# Altium schematic sheet Fan.SchDoc: Fan & Heater Control
size A4; Engineer: A. Küllenberg; Revision: A; SheetNumber: 9; SheetTotal: 10
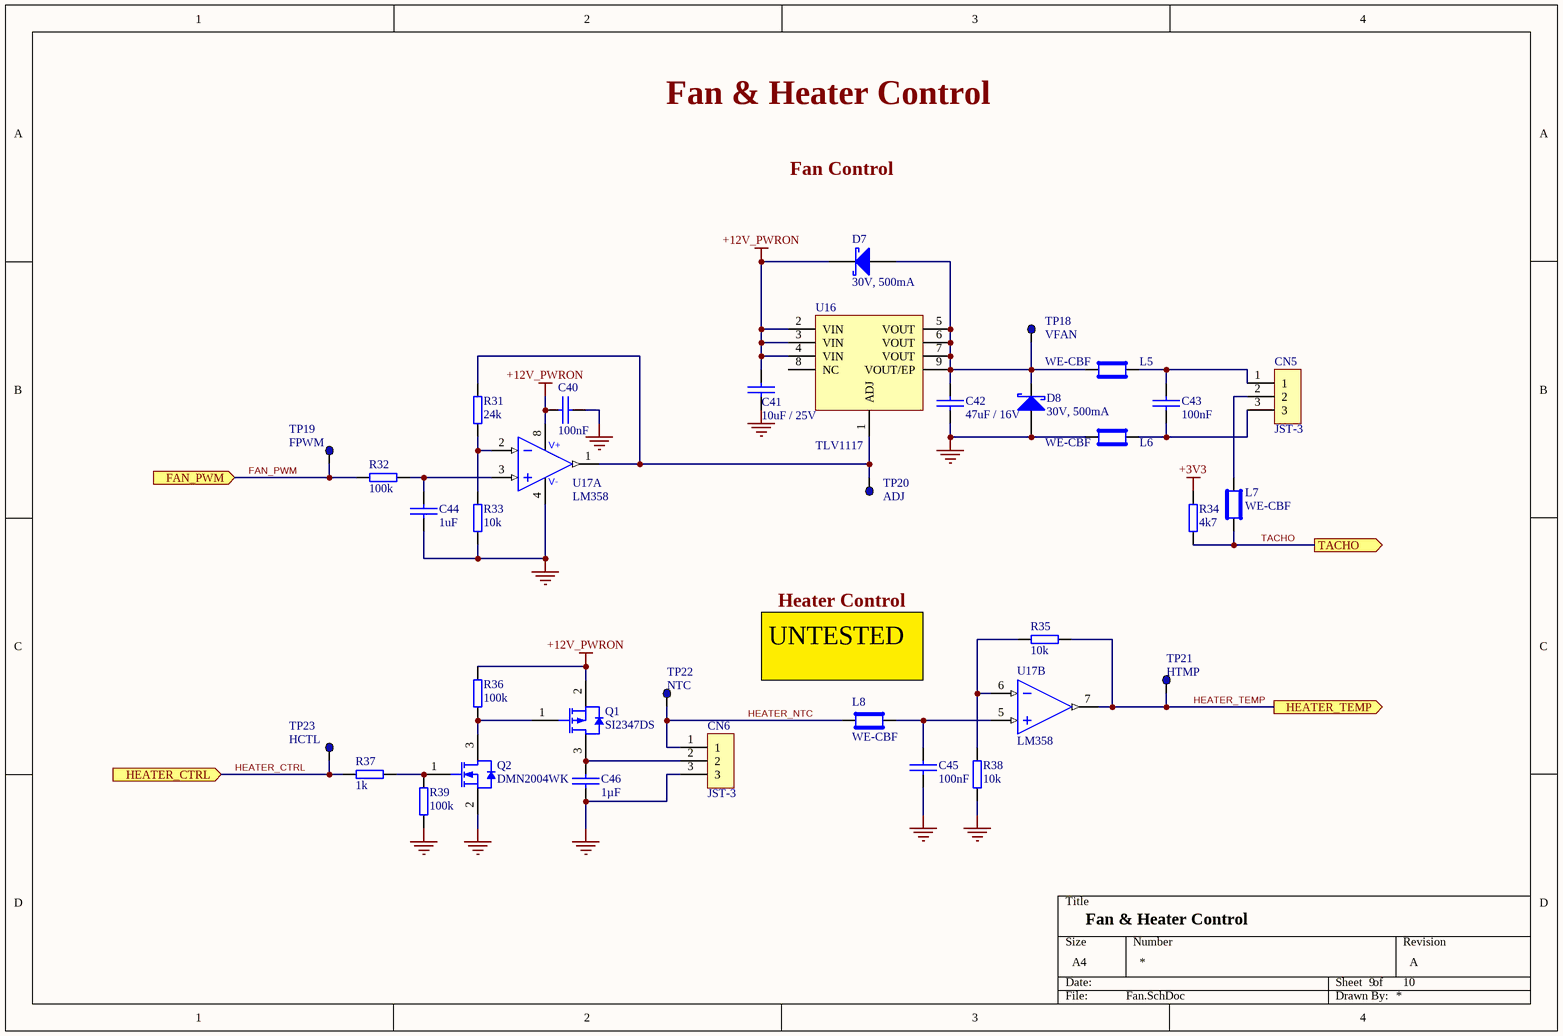
[diagram p0: Fan.SchDoc]

## Parts
C40  100nF  [C0603]
C41  10uF / 25V  [C0603]
C42  47uF / 16V  [C1206]
C43  100nF  [C0603]
C44  1uF  [C0603]
C45  100nF  [C0603]
C46  1µF  [C0805]
CN5  JST-3  [JST-3]
CN6  JST-3  [JST-3]
D7  30V, 500mA  [SOD523_N]
D8  30V, 500mA  [SOD523_N]
L5  WE-CBF  [L0603]
L6  WE-CBF  [L0603]
L7  WE-CBF  [L0603]
L8  WE-CBF  [L0603]
Q1  SI2347DS  [SOT23-3_N]
Q2  DMN2004WK  [SC-70]
R31  24k  [R0603]
R32  100k  [R0603]
R33  10k  [R0603]
R34  4k7  [R0603]
R35  10k  [R0603]
R36  100k  [R0603]
R37  1k  [R0603]
R38  10k  [R0603]
R39  100k  [R0603]
TP18  VFAN  [TP_1mm]  (no BOM)
TP19  FPWM  [TP_1mm]  (no BOM)
TP20  ADJ  [TP_1mm]  (no BOM)
TP21  HTMP  [TP_1mm]  (no BOM)
TP22  NTC  [TP_1mm]  (no BOM)
TP23  HCTL  [TP_1mm]  (no BOM)
U16  TLV1117  [QFN80P400X400X80_HS-9N]
U17  LM358  [DFN 2x2_LM358]  (parts A,B of 2)

## Ports
FAN_PWM (in), HEATER_CTRL (in), HEATER_TEMP (out), TACHO (out)

## Nets
+3V3: R34.2
+12V_PWRON: C40.1 C41.2 D7.2(K) Q1.2(S) R36.2 U16.2(VIN) U16.3(VIN) U16.4(VIN) U17.8(V+)
GND: C40.2 C41.1 C42.1 C44.1 C45.1 C46.1 CN6.3 D8.1(A) L6.1 Q2.2(S) R33.2 R38.1 R39.1 U17.4(V-)
FAN_PWM: R32.1 TP19.1 ; port FAN_PWM
HEATER_CTRL: R37.2 TP23.1 ; port HEATER_CTRL
HEATER_NTC: CN6.1 L8.1 TP22.1
HEATER_TEMP: R35.2 TP21.1 U17.7(OUT) ; port HEATER_TEMP
TACHO: L7.1 R34.1 ; port TACHO
NetC42_2: C42.2 D7.1(A) D8.2(K) L5.1 TP18.1 U16.5(VOUT) U16.6(VOUT) U16.7(VOUT) U16.9(VOUT/EP)
NetC43_1: C43.1 CN5.3 L6.2
NetC43_2: C43.2 CN5.1 L5.2
NetC44_2: C44.2 R32.2 U17.3(IN+)
NetC45_2: C45.2 L8.2 U17.5(IN+)
NetC46_2: C46.2 CN6.2 Q1.3(D)
NetCN5_2: CN5.2 L7.2
NetQ1_1: Q1.1(G) Q2.3(D) R36.1
NetQ2_1: Q2.1(G) R37.1 R39.2
NetR31_1: R31.1 R33.1 U17.2(IN-)
NetR31_2: R31.2 TP20.1 U16.1(ADJ) U17.1(OUT)
NetR35_1: R35.1 R38.2 U17.6(IN-)

Not connected (* = marked no-connect by the designer): U16 8(NC)

## Notes on the sheet
- Fan & Heater Control
- Fan Control
- Heater Control
- (near L8) UNTESTED

## Library data of the parts
C40 C43 C45 = C0603C104K5RACTU: CAP CER 0.1UF 50V X7R 0603; Manufacturer: Kemet; Capacitance: 0.10µF; Tolerance: ±10%; Part Number: C0603C104K5RACTU; Value: 100nF; Supplier 1: Digi-Key; Supplier Part Number 1: 399-5089-1-ND; Manufacturer Part Number: C0603C104K5RACTU; RoHS: RoHS Compliant; Category: Capacitors; Stock 1: 1628757; Pricing 1: 1=0.09, 10=0.037, 50=0.0198, 100=0.0167, 250=0.01372, 500=0.01174, 1000=0.00914 (EUR); Packaging: Cut Tape (CT); Voltage - Rated: 50V; Temperature Coefficient: X7R; Mounting Type: Surface Mount, MLCC; Operating Temperature: -55°C ~ 125°C; Applications: General Purpose; Ratings: -; Package / Case: 0603 (1608 Metric); Size / Dimension: 0.063" L x 0.031" W (1.60mm x 0.80mm); Height - Seated (Max): -; Thickness (Max): 0.034" (0.87mm); Lead Spacing: -; Features: -; Lead Style: -; ComponentLink1URL: http://www.kemet.com/docfinder?Partnumber=C0603C104K5RACTU; ComponentLink1Description: http://www.kemet.com/docfinder?Partnumber=C0603C104K5RACTU
C41 = ZRB18AR61E106ME01L: CAP CER 10UF 25V X5R 0603; Manufacturer: Murata Electronics North America; Capacitance: 10µF; Tolerance: ±20%; Part Number: ZRB18AR61E106ME01L; Value: 10uF / 25V; Supplier 1: Digi-Key; Supplier Part Number 1: 490-10991-1-ND; Manufacturer Part Number: ZRB18AR61E106ME01L; RoHS: RoHS Compliant; Category: Capacitors; Stock 1: 23575; Pricing 1: 1=0.4, 10=0.278, 25=0.2284, 50=0.195, 100=0.1671, 250=0.13924, 500=0.12532, 1000=0.10583 (EUR); Packaging: Cut Tape (CT); Voltage - Rated: 25V; Temperature Coefficient: X5R; Mounting Type: Surface Mount, MLCC; Operating Temperature: -55°C ~ 85°C; Applications: Acoustic Noise Reduction; Ratings: -; Package / Case: 0603 (1608 Metric); Size / Dimension: 0.063" L x 0.031" W (1.60mm x 0.80mm); Height - Seated (Max): -; Thickness (Max): 0.047" (1.20mm); Lead Spacing: -; Features: Interposer Termination; Lead Style: -; ComponentLink1URL: http://search.murata.co.jp/Ceramy/image/img/A01X/G101/ENG/ZRB18AR61E106ME01-01.pdf; ComponentLink1Description: http://search.murata.co.jp/Ceramy/image/img/A01X/G101/ENG/ZRB18AR61E106ME01-01.pdf; Part Status: Active
C42 = C3216X5R1C476M160AB: CAP CER 47UF 16V X5R 1206; Manufacturer: TDK Corporation; Capacitance: 47µF; Tolerance: ±20%; Part Number: C3216X5R1C476M160AB; Value: 47uF / 16V; Supplier 1: Digi-Key; Supplier Part Number 1: 445-6003-1-ND; Manufacturer Part Number: C3216X5R1C476M160AB; RoHS: RoHS Compliant; Category: Capacitors; Stock 1: 181623; Pricing 1: 1=0.92, 10=0.724, 25=0.6636, 50=0.6272, 100=0.5427, 250=0.48244, 500=0.41008, 1000=0.36184 (EUR); Packaging: Cut Tape (CT); Voltage - Rated: 16V; Temperature Coefficient: X5R; Mounting Type: Surface Mount, MLCC; Operating Temperature: -55°C ~ 85°C; Applications: General Purpose; Ratings: -; Package / Case: 1206 (3216 Metric); Size / Dimension: 0.126" L x 0.063" W (3.20mm x 1.60mm); Height - Seated (Max): -; Thickness (Max): 0.071" (1.80mm); Lead Spacing: -; Features: Low ESL; Lead Style: -; ComponentLink1URL: https://product.tdk.com/info/en/catalog/datasheets/mlcc_commercial_general_en.pdf; ComponentLink1Description: https://product.tdk.com/info/en/catalog/datasheets/mlcc_commercial_general_en.pdf; Part Status: Active; Failure Rate: -
C44 = GCM188R71E105KA64D: CAP CER 1UF 25V X7R 0603; Manufacturer: Murata Electronics North America; Capacitance: 1µF; Tolerance: ±10%; Part Number: GCM188R71E105KA64D; Value: 1uF; Supplier 1: Digi-Key; Supplier Part Number 1: 490-10673-1-ND; Manufacturer Part Number: GCM188R71E105KA64D; RoHS: RoHS Compliant; Category: Capacitors; Stock 1: 53908; Pricing 1: 1=0.19, 10=0.13, 50=0.0748, 100=0.0617, 250=0.05196, 500=0.04352, 1000=0.03572 (EUR); Packaging: Cut Tape (CT); Voltage - Rated: 25V; Temperature Coefficient: X7R; Mounting Type: Surface Mount, MLCC; Operating Temperature: -55°C ~ 125°C; Applications: Automotive; Ratings: AEC-Q200; Package / Case: 0603 (1608 Metric); Size / Dimension: 0.063" L x 0.031" W (1.60mm x 0.80mm); Height - Seated (Max): -; Thickness (Max): 0.035" (0.90mm); Lead Spacing: -; Features: -; Lead Style: -; ComponentLink1URL: http://www.murata.com/~/media/webrenewal/support/library/catalog/products/capacitor/mlcc/c03e.ashx; ComponentLink1Description: http://www.murata.com/~/media/webrenewal/support/library/catalog/products/capacitor/mlcc/c03e.ashx
C46 = C0805C105K5RACTU: CAP CER 1UF 50V X7R 0805; Manufacturer: Kemet; Tolerance: ±10%; Part Number: C0805C105K5RACTU; Value: 1µF; Supplier 1: Digi-Key; Supplier Part Number 1: 399-7409-1-ND; Manufacturer Part Number: C0805C105K5RACTU; RoHS: RoHS Compliant; Category: Capacitors; Stock 1: 161342; Pricing 1: 1=0.31, 10=0.254, 50=0.1428, 100=0.1268, 250=0.09508, 500=0.084, 1000=0.07449 (EUR); Packaging: Cut Tape (CT); Capacitance: 1µF; Voltage - Rated: 50V; Temperature Coefficient: X7R; Mounting Type: Surface Mount, MLCC; Operating Temperature: -55°C ~ 125°C; Applications: General Purpose; Ratings: -; Package / Case: 0805 (2012 Metric); Size / Dimension: 0.079" L x 0.049" W (2.00mm x 1.25mm); Height - Seated (Max): -; Thickness (Max): 0.055" (1.40mm); Lead Spacing: -; Features: -; Lead Style: -; ComponentLink1URL: http://www.kemet.com/docfinder?Partnumber=C0805C105K5RACTU; ComponentLink1Description: http://www.kemet.com/docfinder?Partnumber=C0805C105K5RACTU
CN5 CN6 = B3B-XH-A(LF)(SN): CONN HEADER XH TOP 3POS 2.5MM; Manufacturer: JST Sales America Inc.; Number of Positions: 3; Number of Positions Loaded: All; Current Rating: 3A; Voltage Rating: 250V; Pitch - Mating: 0.098" (2.50mm); Shrouding: Shrouded - 4 Wall; Style: Board to Cable/Wire; Contact Length - Post: 0.134" (3.40mm); Material Flammability Rating: UL94 V-0; Mated Stacking Heights: 9.8mm; Part Number: B3B-XH-A(LF)(SN); Value: JST-3; Supplier 1: Digi-Key; Supplier Part Number 1: 455-2248-ND; Manufacturer Part Number: B3B-XH-A(LF)(SN); RoHS: RoHS Compliant; Category: Connectors, Interconnects; Stock 1: 206315; Pricing 1: 1=0.18, 10=0.171, 100=0.1053, 500=0.08712, 1000=0.07623, 5000=0.06534, 10000=0.06352 (EUR); Packaging: Bulk; Connector Type: Header; Contact Type: Male Pin; Number of Rows: 1; Mounting Type: Through Hole; Termination: Press-Fit, Solder; Fastening Type: Detent Lock; Features: -; ComponentLink1URL: http://www.jst-mfg.com/product/pdf/eng/eXH.pdf; ComponentLink1Description: http://www.jst-mfg.com/product/pdf/eng/eXH.pdf; Contact Material: Brass; Operating Temperature: -25°C ~ 85°C; Part Status: Active; Row Spacing - Mating: -; Contact Length - Mating: -; Contact Finish - Mating: Tin; Contact Finish Thickness - Mating: -; Insulation Color: Natural; Overall Contact Length: -; Insulation Height: 0.276" (7.00mm); Contact Shape: Square; Ingress Protection: -; Contact Finish - Post: Tin; Insulation Material: Polyamide (PA66), Nylon 6/6; Contact Finish Thickness - Post: -; Applications: -
D7 D8 = BAS 3005B-02V H6327: DIODE SCHOTTKY 30V 500MA SC79-2; Manufacturer: Infineon Technologies; Current - Reverse Leakage @ Vr: 25µA @ 30V; Voltage - Forward (Vf) (Max) @ If: 620mV @ 500mA; Current - Average Rectified (Io): 500mA (DC); Speed: Fast Recovery =< 500ns, > 200mA (Io); Capacitance @ Vr, F: 10pF @ 5V, 1MHz; Part Number: BAS 3005B-02V H6327; Value: 30V, 500mA; Supplier 1: Digi-Key; Supplier Part Number 1: BAS 3005B-02V H6327CT-ND; Manufacturer Part Number: BAS 3005B-02V H6327; RoHS: RoHS Compliant; Category: Discrete Semiconductor Products; Stock 1: 33141; Pricing 1: 1=0.34, 10=0.26, 100=0.1619, 500=0.11066, 1000=0.08507 (EUR); Packaging: Cut Tape (CT); Mounting Type: Surface Mount; Package / Case: SC-79, SOD-523; Supplier Device Package: PG-SC79-2; ComponentLink1URL: http://www.infineon.com/dgdl/Infineon-BAS3005B-DS-v01_01-en.pdf?fileId=db3a30432d9b3066012db880a14b0bc1; ComponentLink1Description: http://www.infineon.com/dgdl/Infineon-BAS3005B-DS-v01_01-en.pdf?fileId=db3a30432d9b3066012db880a14b0bc1; Diode Type: Schottky; Voltage - DC Reverse (Vr) (Max): 30V; Reverse Recovery Time (trr): -; Operating Temperature - Junction: -55°C ~ 125°C
L5-L8 = 742792651: FERRITE BEAD 600 OHM 0603 1LN; Manufacturer: Wurth Electronics Inc.; Filter Type: Signal Line; Number of Lines: 1; Impedance @ Frequency: 600 Ohm @ 100MHz; Current Rating (Max): 1A; DC Resistance (DCR) (Max): 200 mOhm; Part Number: 742792651; Value: WE-CBF; Supplier 1: Digi-Key; Supplier Part Number 1: 732-1593-1-ND; Manufacturer Part Number: 742792651; RoHS: RoHS Compliant; Category: Filters; Stock 1: 99870; Pricing 1: 1=0.22, 10=0.185, 50=0.1806, 100=0.1667, 1000=0.15164 (EUR); Packaging: Cut Tape (CT); Part Status: Active; Ratings: -; Operating Temperature: -55°C ~ 125°C; Package / Case: 0603 (1608 Metric); Mounting Type: Surface Mount; Height (Max): 0.039" (1.00mm); Size / Dimension: 0.063" L x 0.031" W (1.60mm x 0.80mm); ComponentLink1URL: http://katalog.we-online.de/pbs/datasheet/742792651.pdf; ComponentLink1Description: http://katalog.we-online.de/pbs/datasheet/742792651.pdf
Q1 = SI2347DS-T1-GE3: MOSFET P-CH 30V 5A SOT-23; Manufacturer: Vishay Siliconix; FET Type: P-Channel; Current - Continuous Drain (Id) @ 25°C: 5A (Tc); Rds On (Max) @ Id, Vgs: 42 mOhm @ 3.8A, 10V; Vgs(th) (Max) @ Id: 2.5V @ 250µA; Drive Voltage (Max Rds On,  Min Rds On): 4.5V, 10V; Gate Charge (Qg) (Max) @ Vgs: 22nC @ 10V; Input Capacitance (Ciss) (Max) @ Vds: 705pF @ 15V; Vgs (Max): ±20V; Power Dissipation (Max): 1.7W (Tc); Part Number: SI2347DS-T1-GE3; Value: SI2347DS; Supplier 1: Digi-Key; Supplier Part Number 1: SI2347DS-T1-GE3CT-ND; Manufacturer Part Number: SI2347DS-T1-GE3; RoHS: RoHS Compliant; Category: Discrete Semiconductor Products; Stock 1: 19854; Pricing 1: 1=0.41, 10=0.309, 25=0.2784, 100=0.1922, 250=0.16184, 500=0.13148, 1000=0.10114 (EUR); Packaging: Cut Tape (CT); FET Feature: -; Drain to Source Voltage (Vdss): 30V; Mounting Type: Surface Mount; Package / Case: TO-236-3, SC-59, SOT-23-3; Supplier Device Package: SOT-23-3; ComponentLink1URL: http://www.vishay.com/docs/62827/si2347ds.pdf; ComponentLink1Description: http://www.vishay.com/docs/62827/si2347ds.pdf; Operating Temperature: -55°C ~ 150°C (TJ); Part Status: Active; Technology: MOSFET (Metal Oxide)
Q2 = DMN2004WK-7: MOSFET N-CH 20V 540MA SC70-3; Manufacturer: Diodes Incorporated; FET Type: N-Channel; Current - Continuous Drain (Id) @ 25°C: 540mA (Ta); Rds On (Max) @ Id, Vgs: 550 mOhm @ 540mA, 4.5V; Vgs(th) (Max) @ Id: 1V @ 250µA; Drive Voltage (Max Rds On,  Min Rds On): 1.8V, 4.5V; Input Capacitance (Ciss) (Max) @ Vds: 150pF @ 16V; Vgs (Max): ±8V; Power Dissipation (Max): 200mW (Ta); Part Number: DMN2004WK-7; Value: DMN2004WK; Supplier 1: Digi-Key; Supplier Part Number 1: DMN2004WKDICT-ND; Manufacturer Part Number: DMN2004WK-7; RoHS: RoHS Compliant; Category: Discrete Semiconductor Products; Stock 1: 14846; Pricing 1: 1=0.43, 10=0.324, 100=0.2013, 500=0.13776, 1000=0.10596 (EUR); Packaging: Cut Tape (CT); FET Feature: -; Drain to Source Voltage (Vdss): 20V; Mounting Type: Surface Mount; Package / Case: SC-70, SOT-323; Supplier Device Package: SOT-323; ComponentLink1URL: https://www.diodes.com/assets/Datasheets/ds30934.pdf; ComponentLink1Description: https://www.diodes.com/assets/Datasheets/ds30934.pdf; Operating Temperature: -55°C ~ 150°C (TJ); Part Status: Active; Technology: MOSFET (Metal Oxide); Gate Charge (Qg) (Max) @ Vgs: -
R31 = RC0603FR-0724KL: RES SMD 24K OHM 1% 1/10W 0603; Manufacturer: Yageo; Power (Watts): 0.1W, 1/10W; Temperature Coefficient: ±100ppm/°C; Part Number: RC0603FR-0724KL; Value: 24k; Manufacturer Part Number: RC0603FR-0724KL; RoHS: RoHS Compliant; Category: Resistors; Stock 1: 315278; Pricing 1: 1=0.09, 10=0.012, 25=0.0088, 50=0.0066, 100=0.0049, 250=0.00372, 500=0.00298, 1000=0.0022 (EUR); Packaging: Cut Tape (CT); Resistance (Ohms): 24k; Tolerance: ±1%; Composition: Thick Film; Features: Moisture Resistant; Operating Temperature: -55°C ~ 155°C; Package / Case: 0603 (1608 Metric); Supplier Device Package: 0603; Size / Dimension: 0.063" L x 0.031" W (1.60mm x 0.80mm); ComponentLink1URL: http://www.yageo.com/documents/recent/PYu-RC_Group_51_RoHS_L_6.pdf; ComponentLink1Description: http://www.yageo.com/documents/recent/PYu-RC_Group_51_RoHS_L_6.pdf; Supplier 1: Digi-Key; Supplier Part Number 1: 311-24.0KHRCT-ND; Height - Seated (Max): 0.022" (0.55mm); Part Status: Active; Failure Rate: -
R32 R36 R39 = RC0603FR-07100KL: RES SMD 100K OHM 1% 1/10W 0603; Manufacturer: Yageo; Power (Watts): 0.1W, 1/10W; Temperature Coefficient: ±100ppm/°C; Part Number: RC0603FR-07100KL; Value: 100k; Manufacturer Part Number: RC0603FR-07100KL; RoHS: RoHS Compliant; Category: Resistors; Stock 1: 6595647; Pricing 1: 1=0.09, 10=0.012, 25=0.0088, 50=0.007, 100=0.0051, 250=0.00388, 500=0.0031, 1000=0.00229 (EUR); Packaging: Cut Tape (CT); Resistance (Ohms): 100k; Tolerance: ±1%; Composition: Thick Film; Features: Moisture Resistant; Operating Temperature: -55°C ~ 155°C; Package / Case: 0603 (1608 Metric); Supplier Device Package: 0603; Size / Dimension: 0.063" L x 0.031" W (1.60mm x 0.80mm); ComponentLink1URL: http://www.yageo.com/documents/recent/PYu-RC_Group_51_RoHS_L_7.pdf; ComponentLink1Description: http://www.yageo.com/documents/recent/PYu-RC_Group_51_RoHS_L_7.pdf; Supplier 1: Digi-Key; Supplier Part Number 1: 311-100KHRCT-ND; Height - Seated (Max): 0.022" (0.55mm); Part Status: Active; Failure Rate: -
R33 R35 R38 = RC0603FR-0710KL: RES SMD 10K OHM 1% 1/10W 0603; Manufacturer: Yageo; Power (Watts): 0.1W, 1/10W; Temperature Coefficient: ±100ppm/°C; Part Number: RC0603FR-0710KL; Value: 10k; Manufacturer Part Number: RC0603FR-0710KL; RoHS: RoHS Compliant; Category: Resistors; Stock 1: 14298796; Pricing 1: 1=0.09, 10=0.012, 25=0.0088, 50=0.007, 100=0.0051, 250=0.00388, 500=0.0031, 1000=0.00229 (EUR); Packaging: Cut Tape (CT); Resistance (Ohms): 10k; Tolerance: ±1%; Composition: Thick Film; Features: Moisture Resistant; Operating Temperature: -55°C ~ 155°C; Package / Case: 0603 (1608 Metric); Supplier Device Package: 0603; Size / Dimension: 0.063" L x 0.031" W (1.60mm x 0.80mm); ComponentLink1URL: http://www.yageo.com/documents/recent/PYu-RC_Group_51_RoHS_L_7.pdf; ComponentLink1Description: http://www.yageo.com/documents/recent/PYu-RC_Group_51_RoHS_L_7.pdf; Supplier 1: Digi-Key; Supplier Part Number 1: 311-10.0KHRCT-ND; Height - Seated (Max): 0.022" (0.55mm); Part Status: Active; Failure Rate: -
R34 = CRCW06034K70FKEA: RES SMD 4.7K OHM 1% 1/10W 0603; Manufacturer: Vishay Dale; Power (Watts): 0.1W, 1/10W; Temperature Coefficient: ±100ppm/°C; Part Number: CRCW06034K70FKEA; Value: 4k7; Manufacturer Part Number: CRCW06034K70FKEA; RoHS: RoHS Compliant; Category: Resistors; Stock 1: 324271; Pricing 1: 1=0.09, 10=0.027, 25=0.0196, 50=0.015, 100=0.011, 250=0.0084, 500=0.00674, 1000=0.00496, 2500=0.00431 (EUR); Packaging: Cut Tape (CT); Resistance (Ohms): 4.7k; Tolerance: ±1%; Composition: Thick Film; Features: Automotive AEC-Q200; Operating Temperature: -55°C ~ 155°C; Package / Case: 0603 (1608 Metric); Supplier Device Package: 0603; Size / Dimension: 0.061" L x 0.033" W (1.55mm x 0.85mm); Height: 0.020" (0.50mm); Number of Terminations: 2; ComponentLink1URL: http://www.vishay.com/docs/20035/dcrcwe3.pdf; ComponentLink1Description: http://www.vishay.com/docs/20035/dcrcwe3.pdf; Supplier 1: Digi-Key; Supplier Part Number 1: 541-4.70KHCT-ND
R37 = CRCW06031K00FKEA: RES SMD 1K OHM 1% 1/10W 0603; Manufacturer: Vishay Dale; Power (Watts): 0.1W, 1/10W; Temperature Coefficient: ±100ppm/°C; Part Number: CRCW06031K00FKEA; Value: 1k; Manufacturer Part Number: CRCW06031K00FKEA; RoHS: RoHS Compliant; Category: Resistors; Stock 1: 862886; Pricing 1: 1=0.09, 10=0.027, 25=0.0196, 50=0.015, 100=0.011, 250=0.0084, 500=0.00674, 1000=0.00496, 2500=0.00431 (EUR); Packaging: Cut Tape (CT); Resistance (Ohms): 1k; Tolerance: ±1%; Composition: Thick Film; Features: Automotive AEC-Q200; Operating Temperature: -55°C ~ 155°C; Package / Case: 0603 (1608 Metric); Supplier Device Package: 0603; Size / Dimension: 0.061" L x 0.033" W (1.55mm x 0.85mm); Height: 0.020" (0.50mm); Number of Terminations: 2; ComponentLink1URL: http://www.vishay.com/docs/20035/dcrcwe3.pdf; ComponentLink1Description: http://www.vishay.com/docs/20035/dcrcwe3.pdf; Supplier 1: Digi-Key; Supplier Part Number 1: 541-1.00KHCT-ND
TP18-TP23 = TP: Value: TP; Part Number: TP
U16 = TLV1117IDRJR: IC REG LDO ADJ 0.8A 8SON; Manufacturer: Texas Instruments; Regulator Topology: Positive Adjustable; Voltage - Output: Adjustable; Current - Output: 800mA; Voltage - Dropout (Typical): 1.2V @ 800mA; Voltage - Input: 2.7 V ~ 15 V; Part Number: TLV1117IDRJR; Value: TLV1117; Supplier 1: Digi-Key; Supplier Part Number 1: 296-19517-1-ND; Manufacturer Part Number: TLV1117IDRJR; RoHS: RoHS Compliant; Category: Integrated Circuits (ICs); Stock 1: 3485; Pricing 1: 1=0.62, 10=0.549, 100=0.4209, 500=0.3328 (EUR); Packaging: Cut Tape (CT); Current - Limit (Min): 800mA; Operating Temperature: -40°C ~ 125°C; Mounting Type: Surface Mount; Package / Case: 8-WDFN Exposed Pad; Supplier Device Package: 8-SON (4x4); ComponentLink1URL: http://www.ti.com/lit/ds/symlink/tlv1117.pdf; ComponentLink1Description: http://www.ti.com/lit/ds/symlink/tlv1117.pdf; Part Status: Active
U17 = LM358QT: IC OPAMP GP 1.1MHZ 8DFN; Manufacturer: STMicroelectronics; Amplifier Type: General Purpose; Number of Circuits: 2; Slew Rate: 0.6 V/µs; Current - Supply: 700µA; Current - Output / Channel: 60mA; Voltage - Supply, Single/Dual (±): 3 V ~ 30 V, ±1.5 V ~ 15 V; Part Number: LM358QT; Value: LM358; Supplier 1: Digi-Key; Supplier Part Number 1: 497-12007-1-ND; Manufacturer Part Number: LM358QT; RoHS: RoHS Compliant; Category: Integrated Circuits (ICs); Stock 1: 1511; Pricing 1: 1=0.43, 10=0.324, 100=0.2013, 500=0.13776, 1000=0.10596 (EUR); Packaging: Cut Tape (CT); Output Type: -; -3db Bandwidth: -; Operating Temperature: 0°C ~ 70°C; Mounting Type: Surface Mount; Package / Case: 8-UFDFN Exposed Pad; Supplier Device Package: 8-DFN (2x2); ComponentLink1URL: http://www.st.com/content/ccc/resource/technical/document/datasheet/61/46/87/01/98/ed/44/c5/CD00000464.pdf/files/CD00000464.pdf/jcr:content/translations/en.CD00000464.pdf; ComponentLink1Description: http://www.st.com/content/ccc/resource/technical/document/datasheet/61/46/87/01/98/ed/44/c5/CD00000464.pdf/files/CD00000464.pdf/jcr:content/translations/en.CD00000464.pdf; Part Status: Active